# EAGLE design Slice_v1.1 (EAGLE 6.6.0)
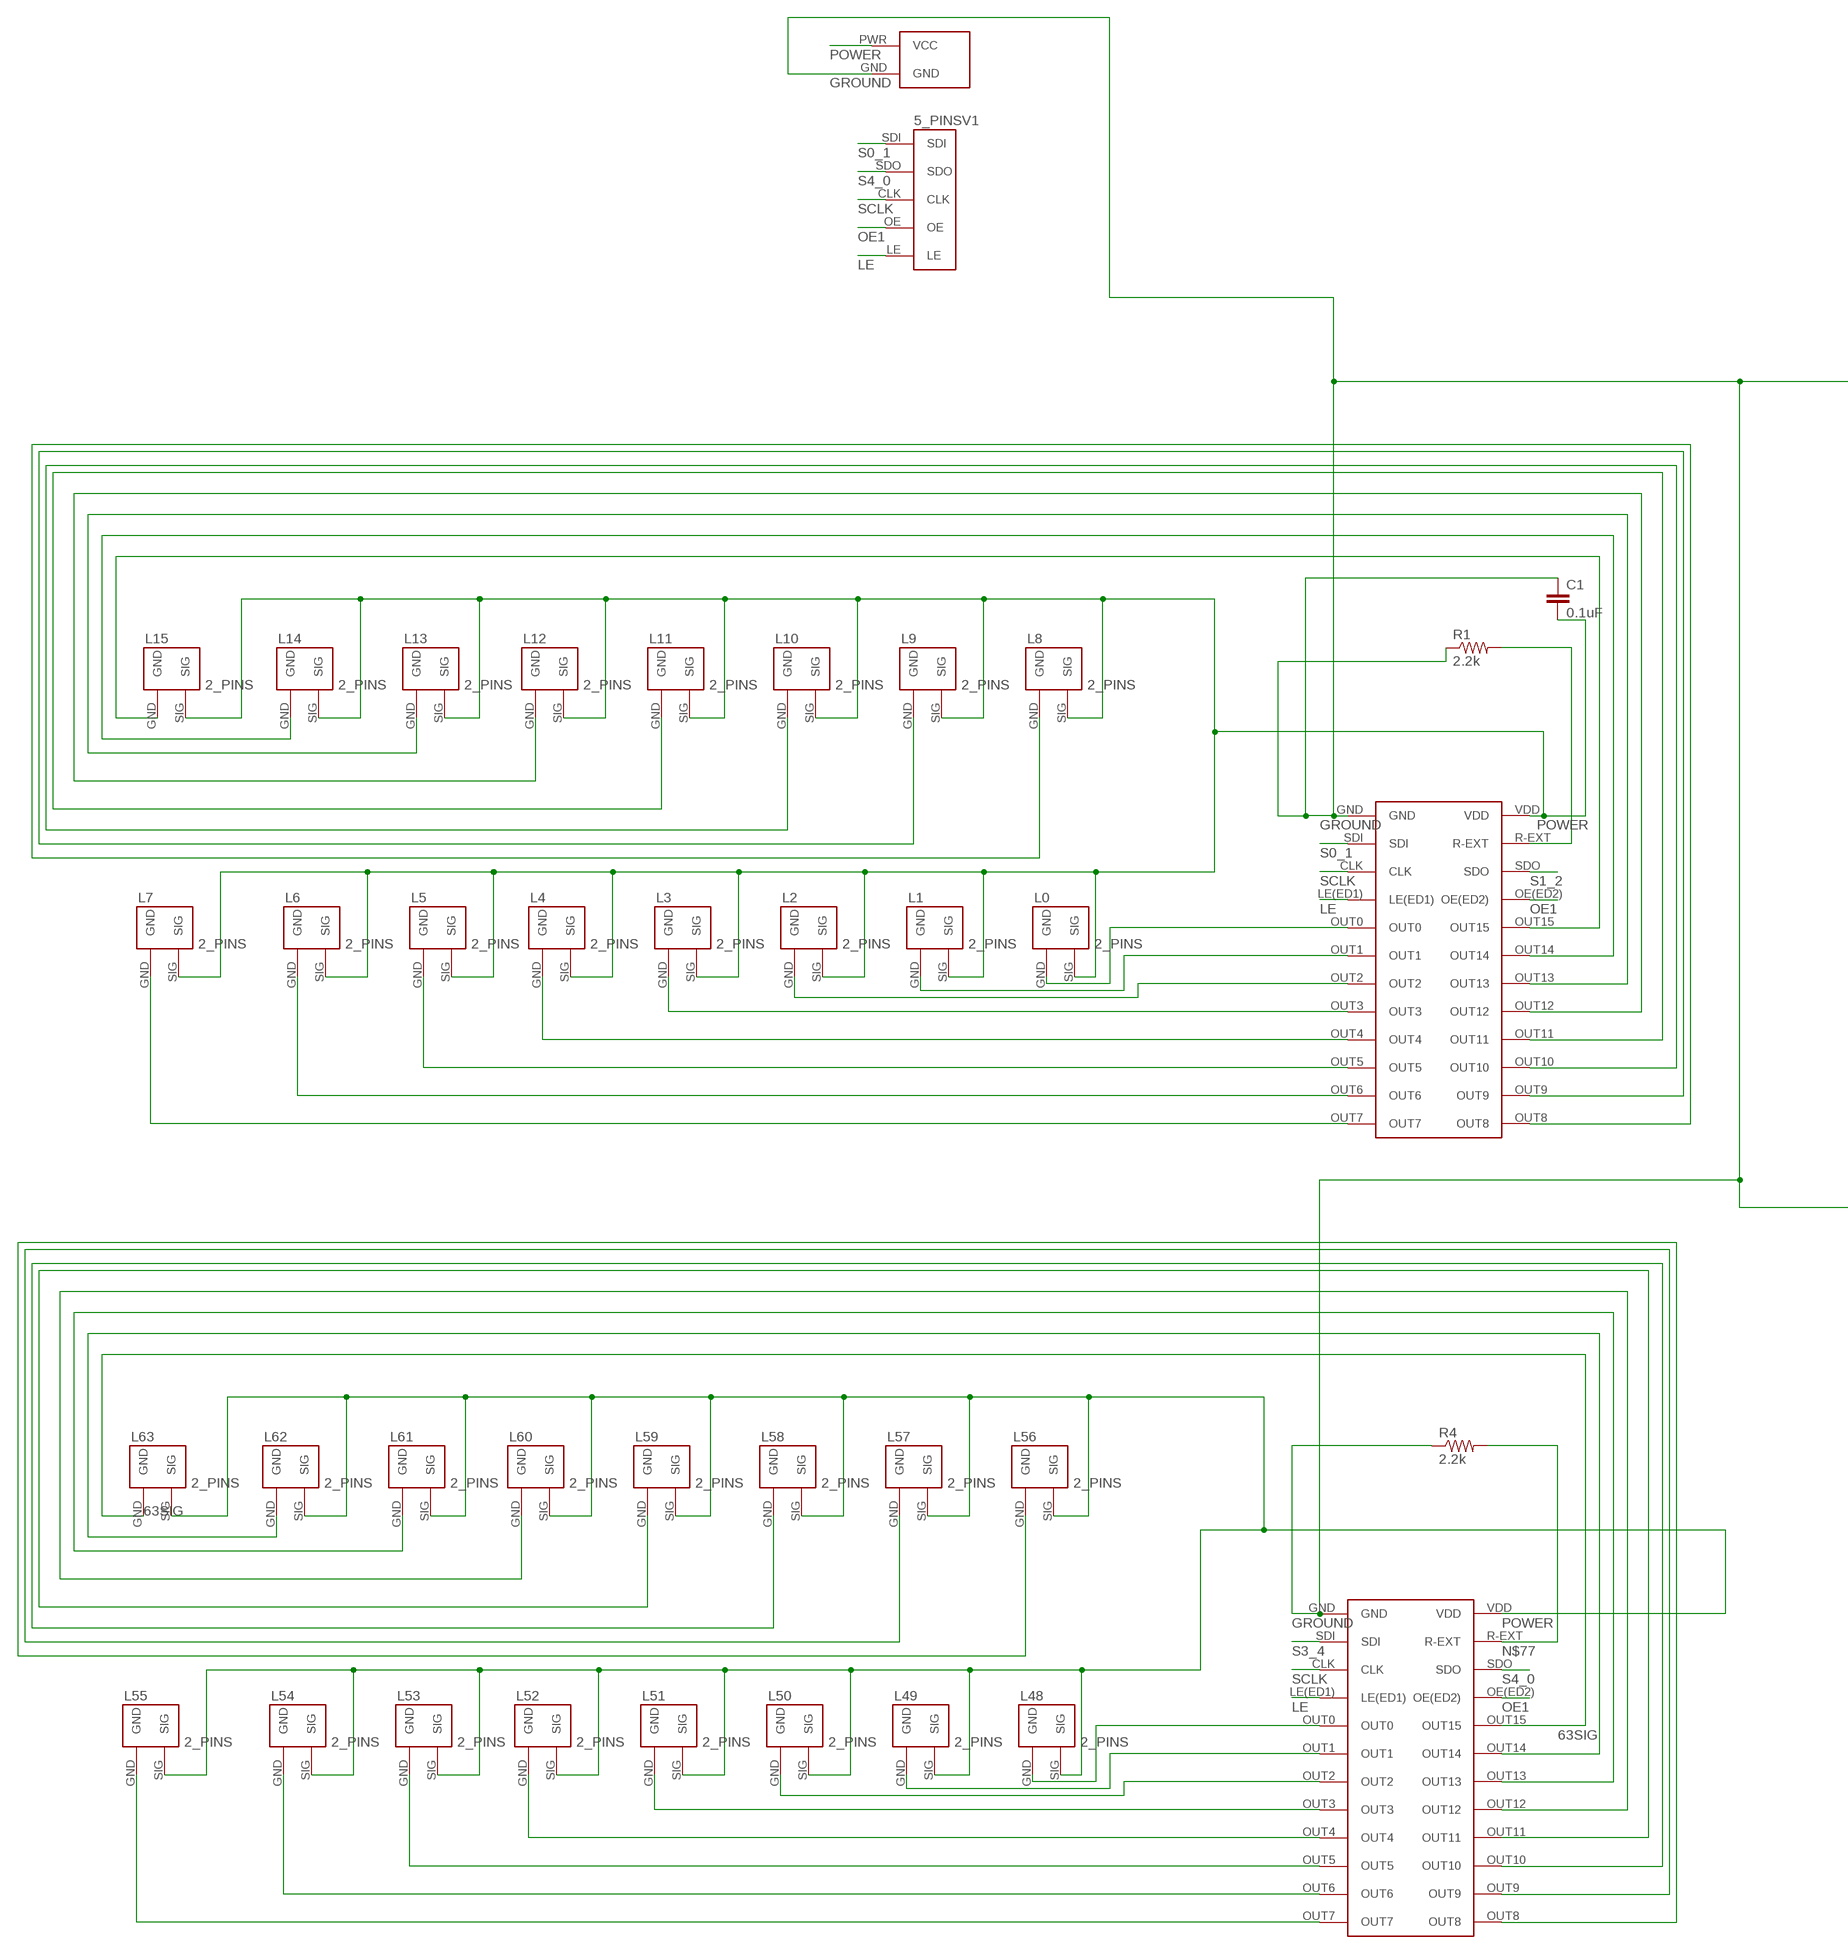
[diagram p0: schematic, sheet 1, part 1 of 2]
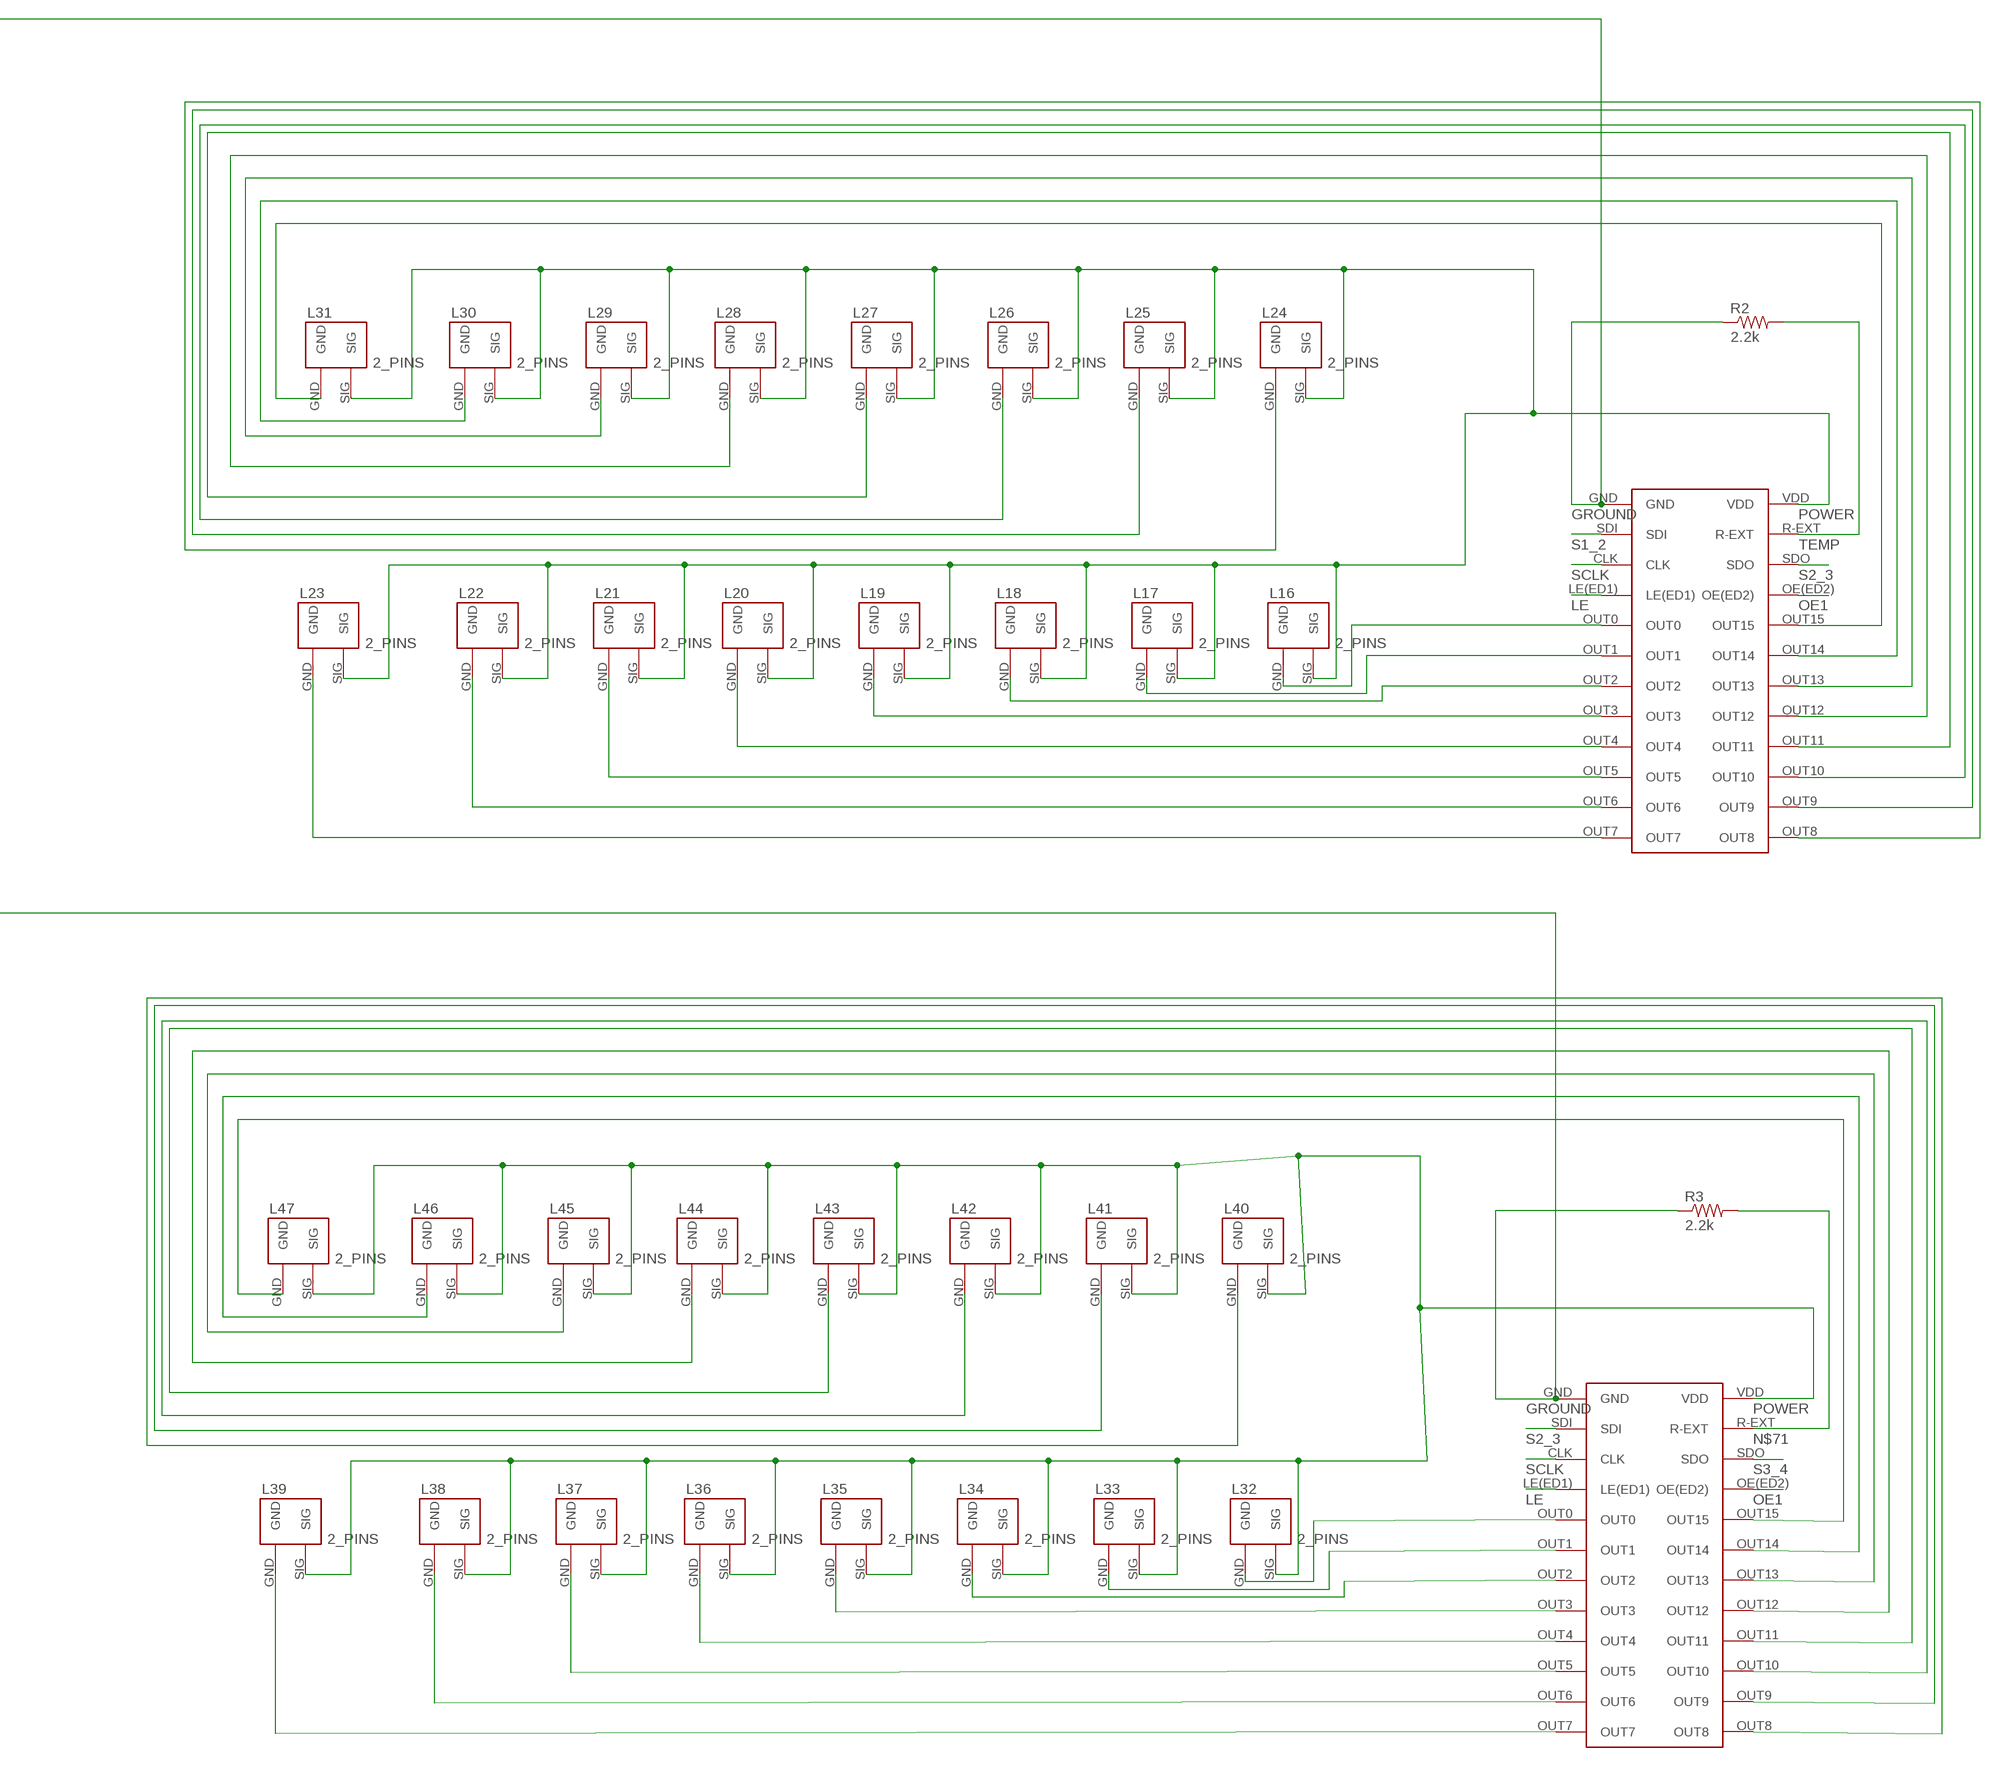
[diagram p1: schematic, sheet 1, part 2 of 2]

## Parts
C1  0.1uF  0.1UF-25V(+80/-20%)(0603)  [0603-CAP]
L0  2_PINS  [2PIN_HOLES]
L1  2_PINS  [2PIN_HOLES]
L2  2_PINS  [2PIN_HOLES]
L3  2_PINS  [2PIN_HOLES]
L4  2_PINS  [2PIN_HOLES]
L5  2_PINS  [2PIN_HOLES]
L6  2_PINS  [2PIN_HOLES]
L7  2_PINS  [2PIN_HOLES]
L8  2_PINS  [2PIN_HOLES]
L9  2_PINS  [2PIN_HOLES]
L10  2_PINS  [2PIN_HOLES]
L11  2_PINS  [2PIN_HOLES]
L12  2_PINS  [2PIN_HOLES]
L13  2_PINS  [2PIN_HOLES]
L14  2_PINS  [2PIN_HOLES]
L15  2_PINS  [2PIN_HOLES]
L16  2_PINS  [2PIN_HOLES]
L17  2_PINS  [2PIN_HOLES]
L18  2_PINS  [2PIN_HOLES]
L19  2_PINS  [2PIN_HOLES]
L20  2_PINS  [2PIN_HOLES]
L21  2_PINS  [2PIN_HOLES]
L22  2_PINS  [2PIN_HOLES]
L23  2_PINS  [2PIN_HOLES]
L24  2_PINS  [2PIN_HOLES]
L25  2_PINS  [2PIN_HOLES]
L26  2_PINS  [2PIN_HOLES]
L27  2_PINS  [2PIN_HOLES]
L28  2_PINS  [2PIN_HOLES]
L29  2_PINS  [2PIN_HOLES]
L30  2_PINS  [2PIN_HOLES]
L31  2_PINS  [2PIN_HOLES]
L32  2_PINS  [2PIN_HOLES]
L33  2_PINS  [2PIN_HOLES]
L34  2_PINS  [2PIN_HOLES]
L35  2_PINS  [2PIN_HOLES]
L36  2_PINS  [2PIN_HOLES]
L37  2_PINS  [2PIN_HOLES]
L38  2_PINS  [2PIN_HOLES]
L39  2_PINS  [2PIN_HOLES]
L40  2_PINS  [2PIN_HOLES]
L41  2_PINS  [2PIN_HOLES]
L42  2_PINS  [2PIN_HOLES]
L43  2_PINS  [2PIN_HOLES]
L44  2_PINS  [2PIN_HOLES]
L45  2_PINS  [2PIN_HOLES]
L46  2_PINS  [2PIN_HOLES]
L47  2_PINS  [2PIN_HOLES]
L48  2_PINS  [2PIN_HOLES]
L49  2_PINS  [2PIN_HOLES]
L50  2_PINS  [2PIN_HOLES]
L51  2_PINS  [2PIN_HOLES]
L52  2_PINS  [2PIN_HOLES]
L53  2_PINS  [2PIN_HOLES]
L54  2_PINS  [2PIN_HOLES]
L55  2_PINS  [2PIN_HOLES]
L56  2_PINS  [2PIN_HOLES]
L57  2_PINS  [2PIN_HOLES]
L58  2_PINS  [2PIN_HOLES]
L59  2_PINS  [2PIN_HOLES]
L60  2_PINS  [2PIN_HOLES]
L61  2_PINS  [2PIN_HOLES]
L62  2_PINS  [2PIN_HOLES]
L63  2_PINS  [2PIN_HOLES]
R1  2.2k  RESISTOREZ  [AXIAL-0.3EZ]
R2  2.2k  RESISTOREZ  [AXIAL-0.3EZ]
R3  2.2k  RESISTOREZ  [AXIAL-0.3EZ]
R4  2.2k  RESISTOREZ  [AXIAL-0.3EZ]
U$1  TLC5926  [TLC5926]
U$2  TLC5926  [TLC5926]
U$3  TLC5926  [TLC5926]
U$4  TLC5926  [TLC5926]
U$6  2PIN_2ATE  [TE_A32471]
U$7  5_PINSV1  [5PIN_HOLES]

## Nets
63SIG: L63.GND U$2.OUT15
GROUND: C1.1 R1.P$1 R2.P$1 R3.P$1 R4.P$1 U$1.GND U$2.GND U$3.GND U$4.GND U$6.GND
GSCL: L31.GND U$4.OUT15
LE: U$1.LE(ED1) U$2.LE(ED1) U$3.LE(ED1) U$4.LE(ED1) U$7.LE
N$1: L7.GND U$1.OUT7
N$2: L6.GND U$1.OUT6
N$3: L5.GND U$1.OUT5
N$4: L4.GND U$1.OUT4
N$5: L3.GND U$1.OUT3
N$6: L2.GND U$1.OUT2
N$7: L1.GND U$1.OUT1
N$8: L0.GND U$1.OUT0
N$9: L15.GND U$1.OUT15
N$10: L14.GND U$1.OUT14
N$11: L13.GND U$1.OUT13
N$12: L12.GND U$1.OUT12
N$13: L11.GND U$1.OUT11
N$14: L10.GND U$1.OUT10
N$15: L9.GND U$1.OUT9
N$16: L8.GND U$1.OUT8
N$18: L23.GND U$4.OUT7
N$19: L22.GND U$4.OUT6
N$20: L21.GND U$4.OUT5
N$21: L20.GND U$4.OUT4
N$22: L19.GND U$4.OUT3
N$23: L18.GND U$4.OUT2
N$24: L17.GND U$4.OUT1
N$25: L16.GND U$4.OUT0
N$27: L30.GND U$4.OUT14
N$28: L29.GND U$4.OUT13
N$29: L28.GND U$4.OUT12
N$30: L27.GND U$4.OUT11
N$31: L26.GND U$4.OUT10
N$32: L25.GND U$4.OUT9
N$33: L24.GND U$4.OUT8
N$35: L55.GND U$2.OUT7
N$36: L54.GND U$2.OUT6
N$37: L53.GND U$2.OUT5
N$38: L52.GND U$2.OUT4
N$39: L51.GND U$2.OUT3
N$40: L50.GND U$2.OUT2
N$41: L49.GND U$2.OUT1
N$42: L48.GND U$2.OUT0
N$44: L62.GND U$2.OUT14
N$45: L61.GND U$2.OUT13
N$46: L60.GND U$2.OUT12
N$47: L59.GND U$2.OUT11
N$48: L58.GND U$2.OUT10
N$49: L57.GND U$2.OUT9
N$50: L56.GND U$2.OUT8
N$52: L39.GND U$3.OUT7
N$53: L38.GND U$3.OUT6
N$54: L37.GND U$3.OUT5
N$55: L36.GND U$3.OUT4
N$56: L35.GND U$3.OUT3
N$57: L34.GND U$3.OUT2
N$58: L33.GND U$3.OUT1
N$59: L32.GND U$3.OUT0
N$61: L46.GND U$3.OUT14
N$62: L45.GND U$3.OUT13
N$63: L44.GND U$3.OUT12
N$64: L43.GND U$3.OUT11
N$65: L42.GND U$3.OUT10
N$66: L41.GND U$3.OUT9
N$67: L40.GND U$3.OUT8
N$68: R1.P$2 U$1.R-EXT
N$71: R3.P$2 U$3.R-EXT
N$77: R4.P$2 U$2.R-EXT
OE1: U$1.OE(ED2) U$2.OE(ED2) U$3.OE(ED2) U$4.OE(ED2) U$7.OE
POWER: C1.2 L0.SIG L1.SIG L2.SIG L3.SIG L4.SIG L5.SIG L6.SIG L7.SIG L8.SIG L9.SIG L10.SIG L11.SIG L12.SIG L13.SIG L14.SIG L15.SIG L16.SIG L17.SIG L18.SIG L19.SIG L20.SIG L21.SIG L22.SIG L23.SIG L24.SIG L25.SIG L26.SIG L27.SIG L28.SIG L29.SIG L30.SIG L31.SIG L32.SIG L33.SIG L34.SIG L35.SIG L36.SIG L37.SIG L38.SIG L39.SIG L40.SIG L41.SIG L42.SIG L43.SIG L44.SIG L45.SIG L46.SIG L47.SIG L48.SIG L49.SIG L50.SIG L51.SIG L52.SIG L53.SIG L54.SIG L55.SIG L56.SIG L57.SIG L58.SIG L59.SIG L60.SIG L61.SIG L62.SIG L63.SIG U$1.VDD U$2.VDD U$3.VDD U$4.VDD U$6.PWR(VCC)
S0_1: U$1.SDI U$7.SDI
S1_2: U$1.SDO U$4.SDI
S2_3: U$3.SDI U$4.SDO
S3_4: U$2.SDI U$3.SDO
S4_0: U$2.SDO U$7.SDO
SCLK: U$1.CLK U$2.CLK U$3.CLK U$4.CLK U$7.CLK
SOUT: L47.GND U$3.OUT15
TEMP: R2.P$2 U$4.R-EXT

## Library data of the parts
C1 = SparkFun-Capacitors:0.1UF-25V(+80/-20%)(0603): CAP-00810 Ceramic Standard decoupling cap; PROD_ID: CAP-00810
L0 L1-L63 = ZacksLib:2_PINS
R1-R4 = SparkFun-Resistors:RESISTOR: Resistor Basic schematic elements and footprints for 0603, 1206, and PTH resistors.
U$1-U$4 = JJR:TLC5926
U$6 = ZacksLib:2PIN_2A
U$7 = ZacksLib:5_PINS

## Board
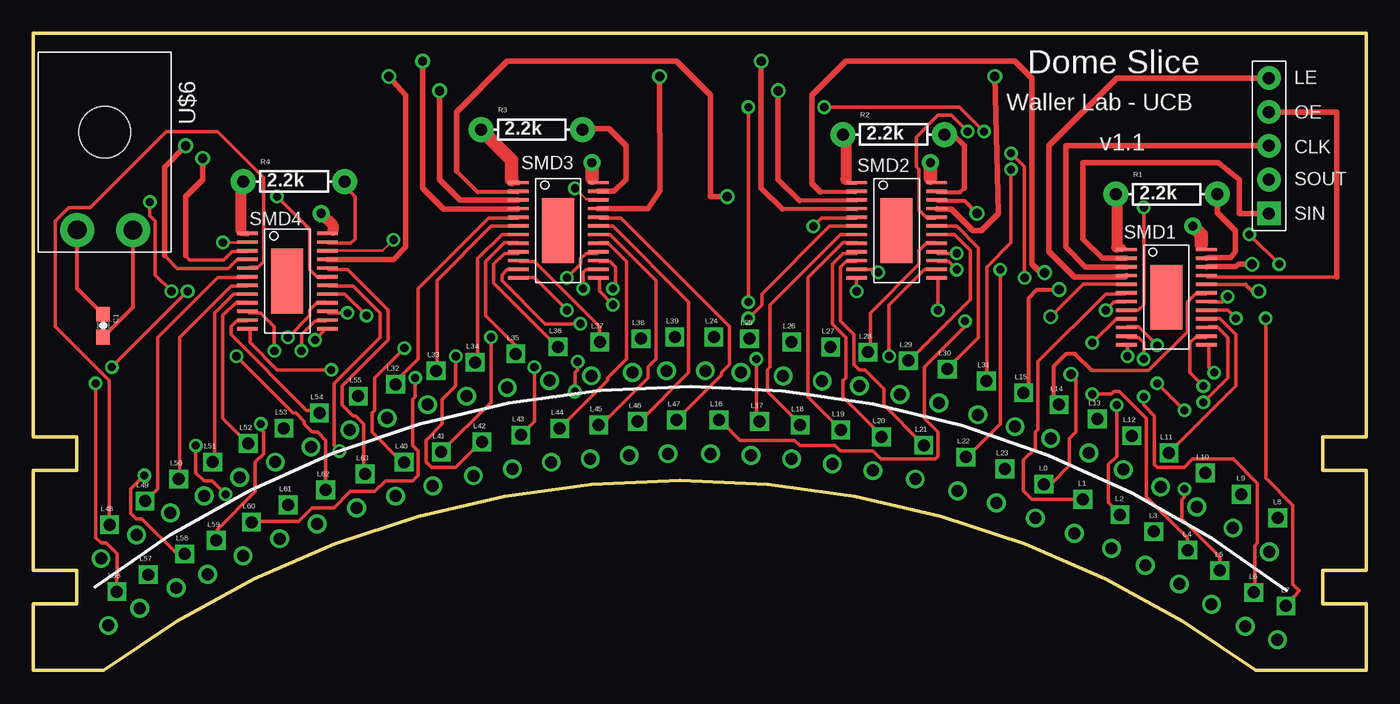
[diagram p2: board, top side]
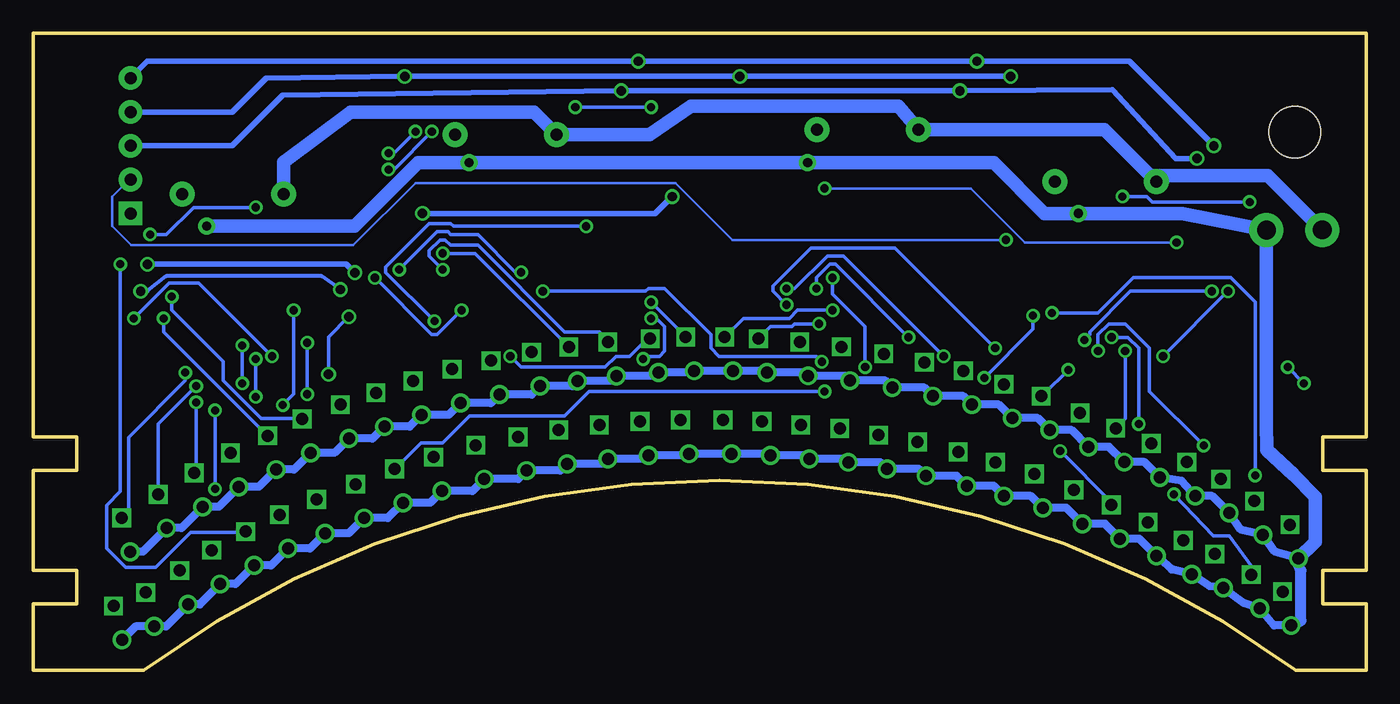
[diagram p3: board, bottom side, seen from below]

Size 100 x 47.81 mm. Coordinates in mm from the lower left corner, seen from the top.
Outline: 0,0 0,5 3.25,5 3.25,7.5 0,7.5 0,15 3.25,15 3.25,17.5 0,17.5 0,47.81 100,47.81 100,17.5 96.75,17.5 96.75,15 100,15 100,7.5 96.75,7.5 96.75,5 100,5 100,0 91.73,0 arc73 5.27,0 0,0
Copper layers (1*16): Top 0.035mm / dielectric 1.5mm / Bottom 0.035mm
Design rules "default *": minimum track width 8mil, minimum drill 24mil, track to track 8mil, track to pad 8mil, pad to pad 8mil, via to via 8mil, smd to smd 8mil, copper to edge 40mil, drill to drill 8mil, minimum pad ring 10mil, minimum via ring 8mil, stop-mask expansion 4mil, vias tented up to drill 0mil, thermal gap 10mil

### Footprints (pad centres in the part's own frame; a part is rotated, then mirrored left to right if it is on the bottom)
0603-CAP = smd 1.1 x 1: 1 -0.85,0; 2 0.85,0
2PIN_HOLES = drill 0.9 pad 1.27 square: GND -1.27,0 | drill 0.9: SIG 1.27,-0.635
AXIAL-0.3EZ = drill 0.9 pad 1.88: P$1 -3.81,0; P$2 3.81,0
TLC5926 = smd 0.25 x 1.55: CLK -2.28,-2.99; GND -3.58,-2.99; LE(ED1) -1.63,-2.99; OE(ED2) -1.63,3.01; OUT0 -0.98,-2.99; OUT1 -0.33,-2.99; OUT2 0.32,-2.99; OUT3 0.97,-2.99; OUT4 1.62,-2.99; OUT5 2.27,-2.99; OUT6 2.92,-2.99; OUT7 3.57,-2.99; OUT8 3.57,3.01; OUT9 2.92,3.01; OUT10 2.27,3.01; OUT11 1.62,3.01; OUT12 0.97,3.01; OUT13 0.32,3.01; OUT14 -0.33,3.01; OUT15 -0.98,3.01; R-EXT -2.93,3.01; SDI -2.93,-2.99; SDO -2.28,3.01; VDD -3.58,3.01 | smd 4.87 x 2.4: P$25 0,0
TE_A32471 = drill 1.4 pad 2.54: GND 2.07,7.34; PWR -2.12,7.35 | hole 3.9: 0,0
5PIN_HOLES = drill 0.9 pad 1.778: CLK 0,0; LE 5.08,0; OE 2.54,0; SDO -2.54,0 | drill 0.9 pad 1.778 square: SDI -5.08,0

### Placement (x,y rotation side)
C1  5.24,25.87 270 top
L0  75.82,12.7 270 top
L1  78.74,11.56 270 top
L2  81.53,10.41 270 top
L3  84.07,9.14 270 top
L4  86.61,7.75 270 top
L5  89.03,6.22 270 top
L6  91.57,4.57 270 top
L7  93.98,3.56 270 top
L8  93.37,10.17 270 top
L9  90.64,11.94 270 top
L10  87.92,13.54 270 top
L11  85.21,15.04 270 top
L12  82.42,16.34 270 top
L13  79.83,17.59 270 top
L14  76.96,18.67 270 top
L15  74.3,19.56 270 top
L16  51.44,17.53 270 top
L17  54.48,17.4 270 top
L18  57.53,17.14 270 top
L19  60.58,16.76 270 top
L20  63.63,16.26 270 top
L21  66.8,15.62 270 top
L22  69.98,14.73 270 top
L23  72.9,13.84 270 top
L24  51.05,23.75 270 top
L25  53.72,23.62 270 top
L26  56.9,23.37 270 top
L27  59.82,22.99 270 top
L28  62.61,22.61 270 top
L29  65.66,21.97 270 top
L30  68.58,21.34 270 top
L31  71.5,20.45 270 top
L32  27.18,20.2 270 top
L33  30.22,21.21 270 top
L34  33.15,21.85 270 top
L35  36.2,22.48 270 top
L36  39.37,23.01 270 top
L37  42.5,23.38 270 top
L38  45.59,23.62 270 top
L39  48.13,23.75 270 top
L40  27.81,14.35 270 top
L41  30.61,15.11 270 top
L42  33.66,15.88 270 top
L43  36.58,16.38 270 top
L44  39.5,16.89 270 top
L45  42.42,17.14 270 top
L46  45.34,17.4 270 top
L47  48.26,17.53 270 top
L48  5.71,9.66 270 top
L49  8.38,11.43 270 top
L50  10.92,13.09 270 top
L51  13.46,14.36 270 top
L52  16.12,15.75 270 top
L53  18.79,16.9 270 top
L54  21.46,18.04 270 top
L55  24.38,19.31 270 top
L56  6.27,4.64 270 top
L57  8.62,5.92 270 top
L58  11.36,7.46 270 top
L59  13.72,8.47 270 top
L60  16.37,9.85 270 top
L61  19.11,11.15 270 top
L62  21.94,12.27 270 top
L63  24.89,13.46 270 top
R1  85.03,35.73 0 top
R2  64.54,40.22 0 top
R3  37.39,40.58 0 top
R4  19.56,36.69 0 top
U$1  85,28 270 top
U$2  19.05,29.21 270 top
U$3  39.37,33.02 270 top
U$4  64.77,33.02 270 top
U$6  5.36,40.39 180 top
U$7  92.71,39.37 90 top

### Tracks (layer width: path | path; a pad name or v marks a point on that pad's centre or on a via)
63SIG
  Top 0.254: U$2.OUT15 22.15,30.07 23.57,30.07 26.62,27.03 26.62,24.79 23.16,21.34 23.16,19.91 23.98,19.1 24.18,19.1 24.79,18.49 24.79,14.83 L63.GND
GROUND
  Top 0.254: U$4.GND 61.77,36.58 61.16,36.58 60.96,36.83
  Top 0.305: 81.7,31.71 U$1.GND | C1.1 3.29,28.66 U$6.GND
  Top 0.406: 35.88,36.83 36.11,36.6 U$3.GND | 15.56,33.02 15.79,32.79 U$2.GND
  Top 0.61: 81.28,31.75 81.7,31.71
  Top 0.813: R4.P$1 15.56,36.5 15.56,33.02 | R2.P$1 60.96,39.98 60.96,36.83 | R1.P$1 81.28,35.67 81.28,31.75
  Top 1.016: R3.P$1 35.88,38.28 35.88,36.83
  Bottom 1.016: R4.P$1 16.2,37.14 | 16.2,37.14 19.64,40.58 R3.P$1 35.1,42.35 50.67,42.35 53.77,40.22 R2.P$1 62.42,41.91 76.2,41.91 81.22,38.16 R1.P$1 | U$6.GND 7.38,37.14 16.2,37.14
GSCL  (via drill 0.61)
  Top 0.254: v70.1,40.44 68.89,41.66 67.87,41.66 66.24,40.03 66.24,37.8 66.45,37.59 66.45,34.54 67.06,33.93 67.67,33.93 U$4.OUT15 | v73.36,37.59 73.36,32.11 71.53,30.28 71.53,21.74 L31.GND
  Bottom 0.254: v70.1,40.44 72.95,37.59 v73.36,37.59
LE  (via drill 0.7)
  Top 0.254: 9.84,31.11 10.79,30.16 14.61,30.16 15.28,30.84 U$2.LE(ED1)
  Top 0.305: U$4.LE(ED1) 61.74,34.61 56.2,34.61
  Top 0.406: 56.2,34.61 54.61,36.2 v54.61,45.72 | U$3.LE(ED1) 36.34,34.61 30.8,34.61 29.21,36.2 v29.21,45.72 | v11.43,39.37 9.84,37.78 9.84,31.11 | U$1.LE(ED1) 81.91,29.53 78.11,29.53 76.2,31.43 76.2,39.37 81.28,44.45 U$7.LE
  Bottom 0.406: U$7.LE 91.44,45.72 v54.61,45.72 v29.21,45.72 17.78,45.72 v11.43,39.37
N$1  (via drill 0.61)
  Top 0.254: v82.09,23.57 82.09,24.38 U$1.OUT7 | v92.46,26.42 92.46,14.43 94.49,12.39 94.49,6.47 94.98,5.98 L7.GND
  Bottom 0.254: v82.09,23.57 87.58,29.06 89.81,29.06 v92.46,26.42
N$2  (via drill 0.61)
  Top 0.254: v83.31,23.37 83.31,24.59 82.91,24.99 82.09,24.99 U$1.OUT6 | v83.31,20.52 83.31,19.91 84.12,19.1 84.12,15.44 84.33,15.24 86.36,15.24 86.97,15.85 90.02,15.85 91.85,14.02 91.85,9.55 91.64,9.35 91.64,5.89 L6.GND
  Bottom 0.254: v83.31,20.52 v83.31,23.37
N$3  (via drill 0.61)
  Top 0.254: v84.33,24.38 82.91,25.81 82.09,25.81 U$1.OUT5 | v86.36,19.51 v84.33,21.54 | v86.36,13.61 86.36,13.01 86.16,12.8 86.16,11.38 89,8.53 89,7.52 L5.GND
  Bottom 0.254: v84.33,21.54 v84.33,24.38 | v86.36,13.61 v86.36,19.51
N$4  (via drill 0.61)
  Top 0.254: v79.45,24.59 81.28,26.42 81.89,26.42 U$1.OUT4 | v79.45,20.73 80.87,20.73 81.08,20.93 81.48,20.93 83.52,18.9 83.52,13.01 86.56,9.96 86.56,9.14 L4.GND
  Bottom 0.254: v79.45,20.73 v79.45,24.59
N$5  (via drill 0.61)
  Top 0.254: v83.31,34.75 83.31,27.43 82.91,27.03 82.09,27.03 U$1.OUT3 | v93.47,30.48 v91.24,32.72
  Bottom 0.254: v83.31,34.75 87.99,34.75 90.02,32.72 v91.24,32.72 | v93.47,30.48 93.47,13.41 94.49,12.39 94.49,9.14 93.07,7.72 90.83,7.72 88.19,10.36 84.12,10.36 L3.GND
N$6  (via drill 0.61)
  Top 0.254: v80.47,27.03 81.08,27.64 81.89,27.64 U$1.OUT2 | v81.28,19.91 81.28,16.05 80.67,15.44 80.67,12.6 81.48,11.79 L2.GND
  Bottom 0.254: v80.47,27.03 80.47,20.73 v81.28,19.91
N$7
  Top 0.254: U$1.OUT1 81.89,28.25 80.47,28.25 75.39,23.16 75.39,18.09 75.18,17.88 75.18,16.66 74.3,15.77 74.3,13.46 74.93,12.83 L1.GND
N$8  (via drill 0.7)
  Top 0.254: v76.33,26.54 78.76,28.98 U$1.OUT0 | v77.85,22.23 78.23,21.84 78.23,17.91 77.72,17.4 77.72,15.37 76.33,13.97 L0.GND
  Bottom 0.254: v76.33,26.54 77.85,25.02 v77.85,22.23
N$9  (via drill 0.7)
  Top 0.254: U$1.OUT15 88.03,28.96 90.93,28.96
  Top 0.305: L15.GND 74.68,21.21 74.68,27.94 75.31,28.57 v76.96,28.57 | 90.93,28.96 91.44,28.45 v91.95,28.45
  Bottom 0.305: v76.96,28.57 78.36,29.59 90.04,29.59 91.44,28.45 v91.95,28.45
N$10
  Top 0.254: 79.4,22.5 83.67,22.5 86.56,25.4 86.56,27.64 87.17,28.25 87.99,28.25 U$1.OUT14
  Top 0.305: L14.GND 76.58,20.32 76.58,22.86 77.47,23.75 78.16,23.75 79.4,22.5
N$11  (via drill 0.61)
  Top 0.254: v89.61,28.04 89.2,27.64 88.19,27.64 U$1.OUT13
  Bottom 0.254: v89.61,28.04 89.61,27.03 85.75,23.16 85.75,21.74 82.91,18.9 79.86,18.9 L13.GND
N$12  (via drill 0.61)
  Top 0.254: v90.22,26.42 89.61,27.03 88.19,27.03 U$1.OUT12
  Bottom 0.254: v90.22,26.42 90.22,25.4 82.5,17.68 L12.GND
N$13
  Top 0.254: U$1.OUT11 88.19,26.42 89,26.42 90.22,25.2 90.22,21.34 85.34,16.46 L11.GND
N$14  (via drill 0.61)
  Top 0.254: v87.78,20.12 89.61,21.95 89.61,24.99 88.8,25.81 88.19,25.81 U$1.OUT10
  Bottom 0.254: v87.78,20.12 87.78,14.83 L10.GND
N$15  (via drill 0.61)
  Top 0.254: v87.78,21.34 86.77,22.35 86.77,24.59 87.17,24.99 87.99,24.99 U$1.OUT9
  Bottom 0.254: v87.78,21.34 90.63,18.49 90.63,13.41 L9.GND
N$16  (via drill 0.61)
  Top 0.254: v88.59,22.35 88.19,22.76 88.19,24.38 U$1.OUT8
  Bottom 0.254: v88.59,22.35 88.59,21.74 92.86,17.48 92.86,11.99 93.27,11.58 L8.GND
N$18  (via drill 0.61)
  Top 0.254: v61.77,28.45 61.77,29.46 U$4.OUT7 | v40.84,23.16 40.84,22.55 40.64,22.35 v40.64,20.93
  Bottom 0.254: v61.77,28.45 54.05,28.45 53.85,28.65 52.63,28.65 49.17,25.2 49.17,24.18 48.56,23.57 41.25,23.57 v40.84,23.16 | v40.64,20.93 58.32,20.93 60.15,19.1 67.26,19.1 69.29,17.07 70.92,17.07 72.75,15.24 L23.GND
N$19  (via drill 0.61)
  Top 0.254: v63.4,29.87 63.2,30.07 61.98,30.07 U$4.OUT6 | v72.54,30.07 72.54,18.49 70.1,16.05 L22.GND
  Bottom 0.254: v63.4,29.87 63.8,29.87 66.65,32.72 68.68,32.72 68.89,32.92 69.7,32.92 v72.54,30.07
N$20
  Top 0.254: U$4.OUT5 61.77,30.68 60.96,30.68 60.55,30.28 60.55,26.21 61.57,25.2 61.57,22.96 61.98,22.55 62.38,22.55 63.8,21.13 63.8,19.91 66.65,17.07 L21.GND
N$21
  Top 0.254: U$4.OUT4 61.77,31.29 60.76,31.29 59.94,30.48 59.94,26.01 60.96,24.99 60.96,21.95 60.76,21.74 60.76,20.52 63.6,17.68 L20.GND
N$22
  Top 0.254: U$4.OUT3 61.77,32.11 60.76,32.11 58.12,29.46 58.12,20.52 60.55,18.09 L19.GND
N$23
  Top 0.254: U$4.OUT2 61.77,32.72 60.55,32.72 55.27,27.43 55.27,22.76 55.07,22.55 55.07,20.93 57.51,18.49 L18.GND
N$24  (via drill 0.61)
  Top 0.254: v53.65,26.42 54.66,27.43 54.66,28.25 59.74,33.33 61.77,33.33 U$4.OUT1 | v54.25,23.37 54.25,18.9 L17.GND
  Bottom 0.254: v53.65,26.42 53.24,26.42 52.63,25.81 52.63,23.98 53.03,23.57 54.05,23.57 v54.25,23.37
N$25  (via drill 0.61)
  Top 0.254: v58.52,33.33 59.13,33.93 61.77,33.93 U$4.OUT0 | v69.9,26.21 69.9,25.81 66.85,22.76 66.85,18.9 67.87,17.88 67.87,16.05 67.67,15.85 63.6,15.85 62.99,16.46 60.55,16.46 60.15,16.87 57.51,16.87 57.1,17.27 53.03,17.27 51.61,18.69 L16.GND
  Bottom 0.254: v58.52,33.33 68.48,33.33 68.68,33.53 70.31,33.53 73.56,30.28 73.56,29.87 v69.9,26.21
N$27
  Top 0.254: U$4.OUT14 67.87,33.33 69.29,33.33 70.92,31.7 70.92,24.99 68.68,22.76 L30.GND
N$28
  Top 0.254: U$4.OUT13 67.87,32.72 69.09,32.72 70.31,31.5 70.31,27.84 65.84,23.37 L29.GND
N$29
  Top 0.254: U$4.OUT12 67.67,32.11 67.06,32.11 66.45,31.5 66.45,30.48 62.79,26.82 62.79,23.98 L28.GND
N$30  (via drill 0.61)
  Top 0.254: v69.29,31.29 67.87,31.29 U$4.OUT11
  Bottom 0.254: v69.29,31.29 66.85,31.29 L27.GND
N$31  (via drill 0.61)
  Top 0.254: v69.29,30.07 68.68,30.68 67.87,30.68 U$4.OUT10
  Bottom 0.254: v69.29,30.07 70.31,31.09 70.31,31.5 69.49,32.31 69.09,32.31 68.68,31.9 66.65,31.9 60.15,25.4 57.51,25.4 56.9,24.79 L26.GND
N$32  (via drill 0.61)
  Top 0.254: v64.21,23.57 64.21,27.43 66.85,30.07 67.67,30.07 U$4.OUT9
  Bottom 0.254: v64.21,23.57 63.4,22.76 57.1,22.76 56.29,23.57 55.27,23.57 53.85,24.99 L25.GND
N$33  (via drill 0.61)
  Top 0.254: v67.87,27.03 67.87,29.46 U$4.OUT8 | v74.37,29.46 74.37,37.8 v73.36,38.81 | v71.32,40.44 69.49,42.27 v59.33,42.27 | v53.65,27.64 v53.65,42.27
  Bottom 0.254: v67.87,27.03 69.7,25.2 70.1,25.2 v74.37,29.46 | v73.36,38.81 72.95,38.81 v71.32,40.44 | v53.65,42.27 v59.33,42.27 | v53.65,27.64 51.21,25.2 L24.GND
N$35  (via drill 0.61)
  Top 0.254: v22.35,22.55 18.29,22.55 16.26,24.59 16.26,25.6 U$2.OUT7
  Bottom 0.254: v22.35,22.55 24.18,20.73 L55.GND
N$36
  Top 0.254: U$2.OUT6 16.05,26.21 15.24,26.21 14.83,25.81 14.83,25.2 20.52,19.51 21.34,19.51 L54.GND
N$37  (via drill 0.61)
  Top 0.254: v18.09,23.98 18.09,25.81 17.07,26.82 16.26,26.82 U$2.OUT5
  Bottom 0.254: v18.09,23.98 18.09,18.9 18.69,18.29 L53.GND
N$38
  Top 0.254: U$2.OUT4 16.05,27.64 15.24,27.64 14.22,26.62 14.22,18.9 16.05,17.07 L52.GND
N$39
  Top 0.254: U$2.OUT3 15.04,28.25 13.61,26.82 13.61,15.65 L51.GND
N$40
  Top 0.254: U$2.OUT2 16.05,28.85 14.83,28.85 10.97,24.99 10.97,14.43 L50.GND
N$41
  Top 0.254: U$2.OUT1 16.05,29.46 13.82,29.46 9.35,24.99 9.35,13.61 8.53,12.8 L49.GND
N$42
  Top 0.254: U$2.OUT0 16.26,30.28 16.87,30.28 17.27,30.68 17.27,36.98 13.82,40.44 9.96,40.44 4.27,34.75 2.64,34.75 1.63,33.73 1.63,25.81 5.69,21.74 5.69,10.97 L48.GND
N$44  (via drill 0.61)
  Top 0.254: v18.29,35.56 20.73,33.12 20.73,30.07 21.34,29.46 21.95,29.46 U$2.OUT14 | v8.74,35.15 8.74,34.14 9.14,33.73 9.14,29.67 v10.36,28.45 | v15.24,23.57 19.51,19.3 19.71,19.3 20.32,18.69 20.32,18.49 20.93,17.88 21.34,17.88 21.95,17.27 21.95,13.61 L62.GND
  Bottom 0.254: v18.29,35.56 16.46,35.56 16.05,35.15 v8.74,35.15 | v15.24,23.57 v10.36,28.45
N$45  (via drill 0.61)
  Top 0.254: v22.96,16.46 22.55,16.87 22.55,21.54 26.01,24.99 26.01,26.82 23.98,28.85 22.15,28.85 U$2.OUT13
  Bottom 0.254: v22.96,16.46 19.1,12.6 L61.GND
N$46  (via drill 0.61)
  Top 0.254: v24.99,26.62 23.37,28.25 22.15,28.25 U$2.OUT12 | v28.65,21.95 28.65,20.52 28.45,20.32 28.45,16.87 28.85,16.46 28.85,14.63 28.45,14.22 26.42,14.22 25.6,13.41 23.77,13.41 22.55,12.19 20.93,12.19 19.91,11.18 16.46,11.18 L60.GND
  Bottom 0.254: v24.99,26.62 24.99,25.6 v28.65,21.95
N$47  (via drill 0.61)
  Top 0.254: v19.1,24.99 20.73,26.62 20.73,27.03 21.34,27.64 21.95,27.64 U$2.OUT11 | v17.07,18.49 17.07,18.09 17.27,17.88 17.27,16.26 16.66,15.65 16.66,13.41 13.82,10.57 13.82,9.75 L59.GND
  Bottom 0.254: v19.1,24.99 17.88,24.99 17.07,24.18 v17.07,18.49
N$48  (via drill 0.61)
  Top 0.254: v23.57,26.82 22.15,26.82 U$2.OUT10 | v8.33,14.63 7.32,13.61 7.32,11.79 7.72,11.38 8.13,11.38 10.78,8.73 L58.GND
  Bottom 0.254: v23.57,26.82 20.12,26.82 17.48,29.46 10.16,29.46 8.33,27.64 v8.33,14.63
N$49  (via drill 0.61)
  Top 0.254: v20.12,23.98 20.12,25.2 21.13,26.21 21.95,26.21 U$2.OUT9 | v12.19,16.87 12.19,14.83 12.8,14.22 13.41,14.22 v14.43,13.21
  Bottom 0.254: v20.12,23.98 20.12,25.2 19.3,26.01 18.09,26.01 16.26,24.18 16.26,20.93 v12.19,16.87 | v14.43,13.21 11.46,10.11 10.29,10.11 8.53,7.72 8.53,6.71 L57.GND
N$50  (via drill 0.61)
  Top 0.254: v21.13,24.79 21.95,25.6 U$2.OUT8 | v5.89,22.76 v11.58,28.45 | v4.67,21.54 4.67,9.96 5.08,9.55 5.49,9.55 6.3,8.74 6.3,7.08 6.27,7.05 L56.GND
  Bottom 0.254: v21.13,24.79 20.73,25.2 20.73,25.4 17.68,28.45 v11.58,28.45 | v4.67,21.54 v5.89,22.76
N$52  (via drill 0.61)
  Top 0.254: v40.03,27.03 37.59,29.46 36.58,29.46 U$3.OUT7
  Bottom 0.254: v40.03,27.03 42.67,27.03 43.28,26.42 46.74,26.42 L39.GND
N$53  (via drill 0.61)
  Top 0.254: v41.05,26.01 38.41,26.01 35.15,29.26 35.15,29.67 35.56,30.07 36.37,30.07 U$3.OUT6
  Bottom 0.254: v41.05,26.01 42.88,26.01 43.08,25.81 44.7,25.81 45.52,24.99 L38.GND
N$54
  Top 0.254: U$3.OUT5 36.58,30.68 37.59,30.68 42.47,25.81 42.47,24.79 L37.GND
N$55
  Top 0.254: U$3.OUT4 36.37,31.29 35.36,31.29 34.54,30.48 34.54,29.06 39.22,24.38 L36.GND
N$56
  Top 0.254: U$3.OUT3 36.37,32.11 35.36,32.11 33.93,30.68 33.93,26.62 36.17,24.38 36.17,23.77 L35.GND
N$57
  Top 0.254: U$3.OUT2 36.37,32.72 35.15,32.72 33.33,30.89 33.33,23.16 L34.GND
N$58
  Top 0.254: U$3.OUT1 36.37,33.33 34.34,33.33 30.28,29.26 30.28,22.55 L33.GND
N$59
  Top 0.254: U$3.OUT0 36.37,33.93 34.14,33.93 28.85,28.65 28.85,23.37 27.03,21.54 L32.GND
N$61
  Top 0.254: U$3.OUT14 42.47,33.33 43.48,33.33 49.17,27.64 49.17,22.35 45.52,18.69 L46.GND
N$62
  Top 0.254: U$3.OUT13 42.47,32.72 43.28,32.72 46.74,29.26 46.74,23.37 46.13,22.76 46.13,21.95 42.47,18.29 L45.GND
N$63
  Top 0.254: L44.GND 43.08,21.74 43.08,21.95 44.5,23.37 44.5,30.68 43.08,32.11 42.47,32.11 U$3.OUT12
N$64  (via drill 0.61)
  Top 0.254: v40.03,29.46 41.05,30.48 41.05,30.89 41.45,31.29 42.27,31.29 U$3.OUT11 | v37.59,22.76 37.59,18.69 36.58,17.68 L43.GND
  Bottom 0.254: v40.03,29.46 40.03,28.25 37.59,25.81 v37.59,22.76
N$65  (via drill 0.61)
  Top 0.254: v43.48,28.65 43.69,28.85 43.69,30.28 43.28,30.68 42.47,30.68 U$3.OUT10 | v31.7,23.57 31.7,21.34 30.68,20.32 30.68,18.49 29.46,17.27 29.46,15.65 29.87,15.24 31.7,15.24 33.53,17.07 L42.GND
  Bottom 0.254: v43.48,28.65 42.88,28.65 40.44,31.09 39.22,31.09 v31.7,23.57
N$66  (via drill 0.61)
  Top 0.254: v41.25,28.65 41.25,29.87 41.45,30.07 42.27,30.07 U$3.OUT9 | v34.34,24.99 34.34,20.12 L41.GND
  Bottom 0.254: v41.25,28.65 41.25,29.46 40.23,30.48 39.83,30.48 v34.34,24.99
N$67  (via drill 0.61)
  Top 0.254: v43.48,27.43 42.47,28.45 42.47,29.46 U$3.OUT8 | v27.84,24.18 25.6,21.95 25.6,19.51 25.4,19.3 25.4,17.88 27.64,15.65 L40.GND
  Bottom 0.254: v43.48,27.43 44.5,28.45 44.5,28.85 41.66,31.7 35.36,31.7 v27.84,24.18
N$68
  Top 0.406: U$1.R-EXT 88.19,30.99 89.85,30.99 90.17,31.43 90.17,33.02 88.84,34.35 R1.P$2
N$71
  Top 0.406: R3.P$2 41.26,40.64 43.18,40.64 44.45,39.37 44.45,36.83 43.57,35.95 U$3.R-EXT
N$77
  Top 0.254: U$2.R-EXT 22.13,32.07 23.81,32.07 24.13,32.38 24.13,35.56 23.37,36.32 R4.P$2
OE1  (via drill 0.7)
  Top 0.254: U$1.OE(ED2) 88.11,29.53 97.79,29.53
  Top 0.406: 97.79,29.53 97.79,41.91 U$7.OE | U$3.OE(ED2) 46.1,34.67 47,36 v46.99,44.58 | v26.67,44.58 27.94,43.18 27.94,31.75 27.03,30.84 U$2.OE(ED2) | U$4.OE(ED2) 67.82,34.61 68.9,34.61 70.48,33.02 71.12,33.02 72.39,34.29 v72.14,44.58
  Bottom 0.406: v26.67,44.58 v46.99,44.58 v72.14,44.58 82.55,44.45 85.09,41.91 U$7.OE
POWER  (via drill 0.7 pad 1.27)
  Top 0.254: U$2.VDD 22.31,32.79 22.54,33.02 22.48,33.02 | v41.91,38.09 v41.91,38.1 | 41.91,36.96 42.27,36.6 U$3.VDD | 67.31,36.96 67.67,36.6 U$4.VDD | 87.63,32 88.01,31.62 U$1.VDD
  Top 0.305: C1.2 7.48,27.27 U$6.PWR
  Top 0.813: v21.59,34.29 22.48,33.4 22.48,33.02
  Top 1.016: v41.91,38.09 41.91,36.96 | v67.31,38.1 67.31,36.96 | v87,33.34 87.63,32.7 87.63,32
  Bottom 0.61: L48.SIG 6.85,8.89 L49.SIG 9.39,10.54 L50.SIG 11.55,13.09 L51.SIG 13.84,14.23 L52.SIG 16.64,15.63 L53.SIG 19.3,16.77 L54.SIG 22.1,18.04 L55.SIG 24.64,18.93 L32.SIG 27.56,19.94 L33.SIG 30.23,20.58 L34.SIG 33.15,21.21 L35.SIG 36.08,21.74 L36.SIG 39.1,22.11 L37.SIG 42.11,22.35 L38.SIG 45.08,22.48 L39.SIG L24.SIG 50.55,22.35 L25.SIG 53.34,22.1 L26.SIG 56.64,21.72 L27.SIG 59.56,21.34 L28.SIG 62.61,20.7 L29.SIG 65.66,20.07 L30.SIG 68.83,19.18 L31.SIG 71.75,18.29 L15.SIG 74.55,17.4 L14.SIG 77.4,16.32 L13.SIG 80.44,15.07 L12.SIG 83.08,13.77 L11.SIG 86.08,12.27 L10.SIG 88.88,10.67 L9.SIG 91.78,8.9 L8.SIG | L56.SIG 6.91,3.38 L57.SIG 9.15,5.04 L58.SIG 11.74,6.32 L59.SIG 14.59,7.57 L60.SIG 17.03,9.88 L61.SIG 19.6,10.99 L62.SIG 22.5,12.19 L63.SIG 25.15,13.08 L40.SIG 27.94,13.84 L41.SIG 30.73,14.61 L42.SIG 33.53,15.11 L43.SIG 36.45,15.62 L44.SIG 39.12,15.88 L45.SIG 42.04,16.13 L46.SIG 44.83,16.26 L47.SIG L16.SIG 50.93,16.13 L17.SIG 54.1,15.88 L18.SIG 57.28,15.49 L19.SIG 60.45,14.99 L20.SIG 63.63,14.35 L21.SIG 67.06,13.46 L22.SIG 70.23,12.57 L23.SIG 73.41,11.43 L0.SIG 76.33,10.29 L1.SIG 79.25,9.14 L2.SIG 82.17,7.87 L3.SIG 84.84,6.48 L4.SIG 87.5,4.95 L5.SIG 90.04,3.3 L6.SIG 92.33,3.3 L7.SIG
  Bottom 0.813: L56.SIG 4.89,3.73 4.89,7.49 5.08,7.94 L48.SIG
  Bottom 1.016: L48.SIG 3.81,9.66 3.81,13.02 5.45,14.65 7.45,16.56 7.48,18.59 U$6.PWR 13.81,34.29 v21.59,34.29 24.13,34.29 27.94,38.1 v41.91,38.1 v67.31,38.1 71.12,38.1 75.88,33.34 v87,33.34
S0_1
  Top 0.406: U$7.SDI 90.49,34.29 90.49,36.83 88.9,38.1 78.74,38.1 78.74,32.38 80.19,30.93 U$1.SDI
S1_2  (via drill 0.7)
  Top 0.305: U$4.SDI 61.71,35.88 59.05,35.88
  Top 0.406: U$1.SDO 88.13,30.29 90.17,30.29 90.49,30.48 v91.44,30.48 | 59.05,35.88 58.42,36.51 58.42,43.18 60.96,45.72 73.66,45.72 74.93,44.45 74.93,30.48 75.56,29.84 v75.88,29.84
  Bottom 0.406: v75.88,29.84 76.52,30.48 v91.44,30.48
S2_3  (via drill 0.7)
  Top 0.305: U$4.SDO 67.84,35.24 69.85,35.24 v70.8,34.29 | U$3.SDI 36.31,35.88 33.34,35.88 31.75,37.47
  Top 0.406: 31.75,37.47 31.75,41.91 35.56,45.72 48.26,45.72 50.8,43.18 50.8,35.56 v52.07,35.56
  Bottom 0.406: v52.07,35.56 53.34,34.29 v70.8,34.29
S3_4  (via drill 0.61)
  Top 0.203: v14.22,32.11 16.05,32.11 U$2.SDI | v40.64,36.17 41.45,35.36 42.27,35.36 U$3.SDO
  Bottom 0.203: v14.22,32.11 25.6,32.11 29.67,36.17 v40.64,36.17
S4_0  (via drill 0.61)
  Top 0.203: v27.03,32.31 26.21,31.5 22.15,31.5 U$2.SDO
  Bottom 0.203: v27.03,32.31 47.55,32.31 51.82,36.58 71.32,36.58 76,31.9 92.66,31.9 94.08,33.33 94.08,35.56 92.86,36.78 U$7.SDO
SCLK  (via drill 0.7)
  Top 0.254: U$2.CLK 16,31.43 14.92,31.43 14.29,30.8 11.75,30.8 11.43,31.11
  Top 0.305: U$4.CLK 61.72,35.24 57.47,35.24
  Top 0.406: U$7.CLK 77.47,39.37 77.47,31.75 78.94,30.28 U$1.CLK | 57.47,35.24 55.88,36.83 v55.88,43.5 | v30.48,43.5 30.48,36.83 32.01,35.3 U$3.CLK | 11.43,31.11 11.43,35.56 12.7,36.83 v12.7,38.42
  Bottom 0.406: v12.7,38.42 14.29,38.42 19.05,43.56 v30.48,43.5 v55.88,43.5 81.28,43.18 85.09,39.37 U$7.CLK
SOUT
  Top 0.254: L47.GND 51.61,22.15 51.61,22.35 52.22,22.96 52.22,25.81 44.09,33.93 42.47,33.93 U$3.OUT15
TEMP
  Top 0.305: U$4.R-EXT 67.85,35.88 69.53,35.88 69.85,36.2
  Top 0.406: 69.85,36.2 69.85,39.37 69,40.22 R2.P$2

### Text on the board
tPlace: Dome Slice | LE | Waller Lab - UCB | OE | v1.1 | CLK | SMD3 | SMD2 | SOUT | SIN | SMD4 | SMD1